# EAGLE design Schematic (EAGLE 9.6.2)
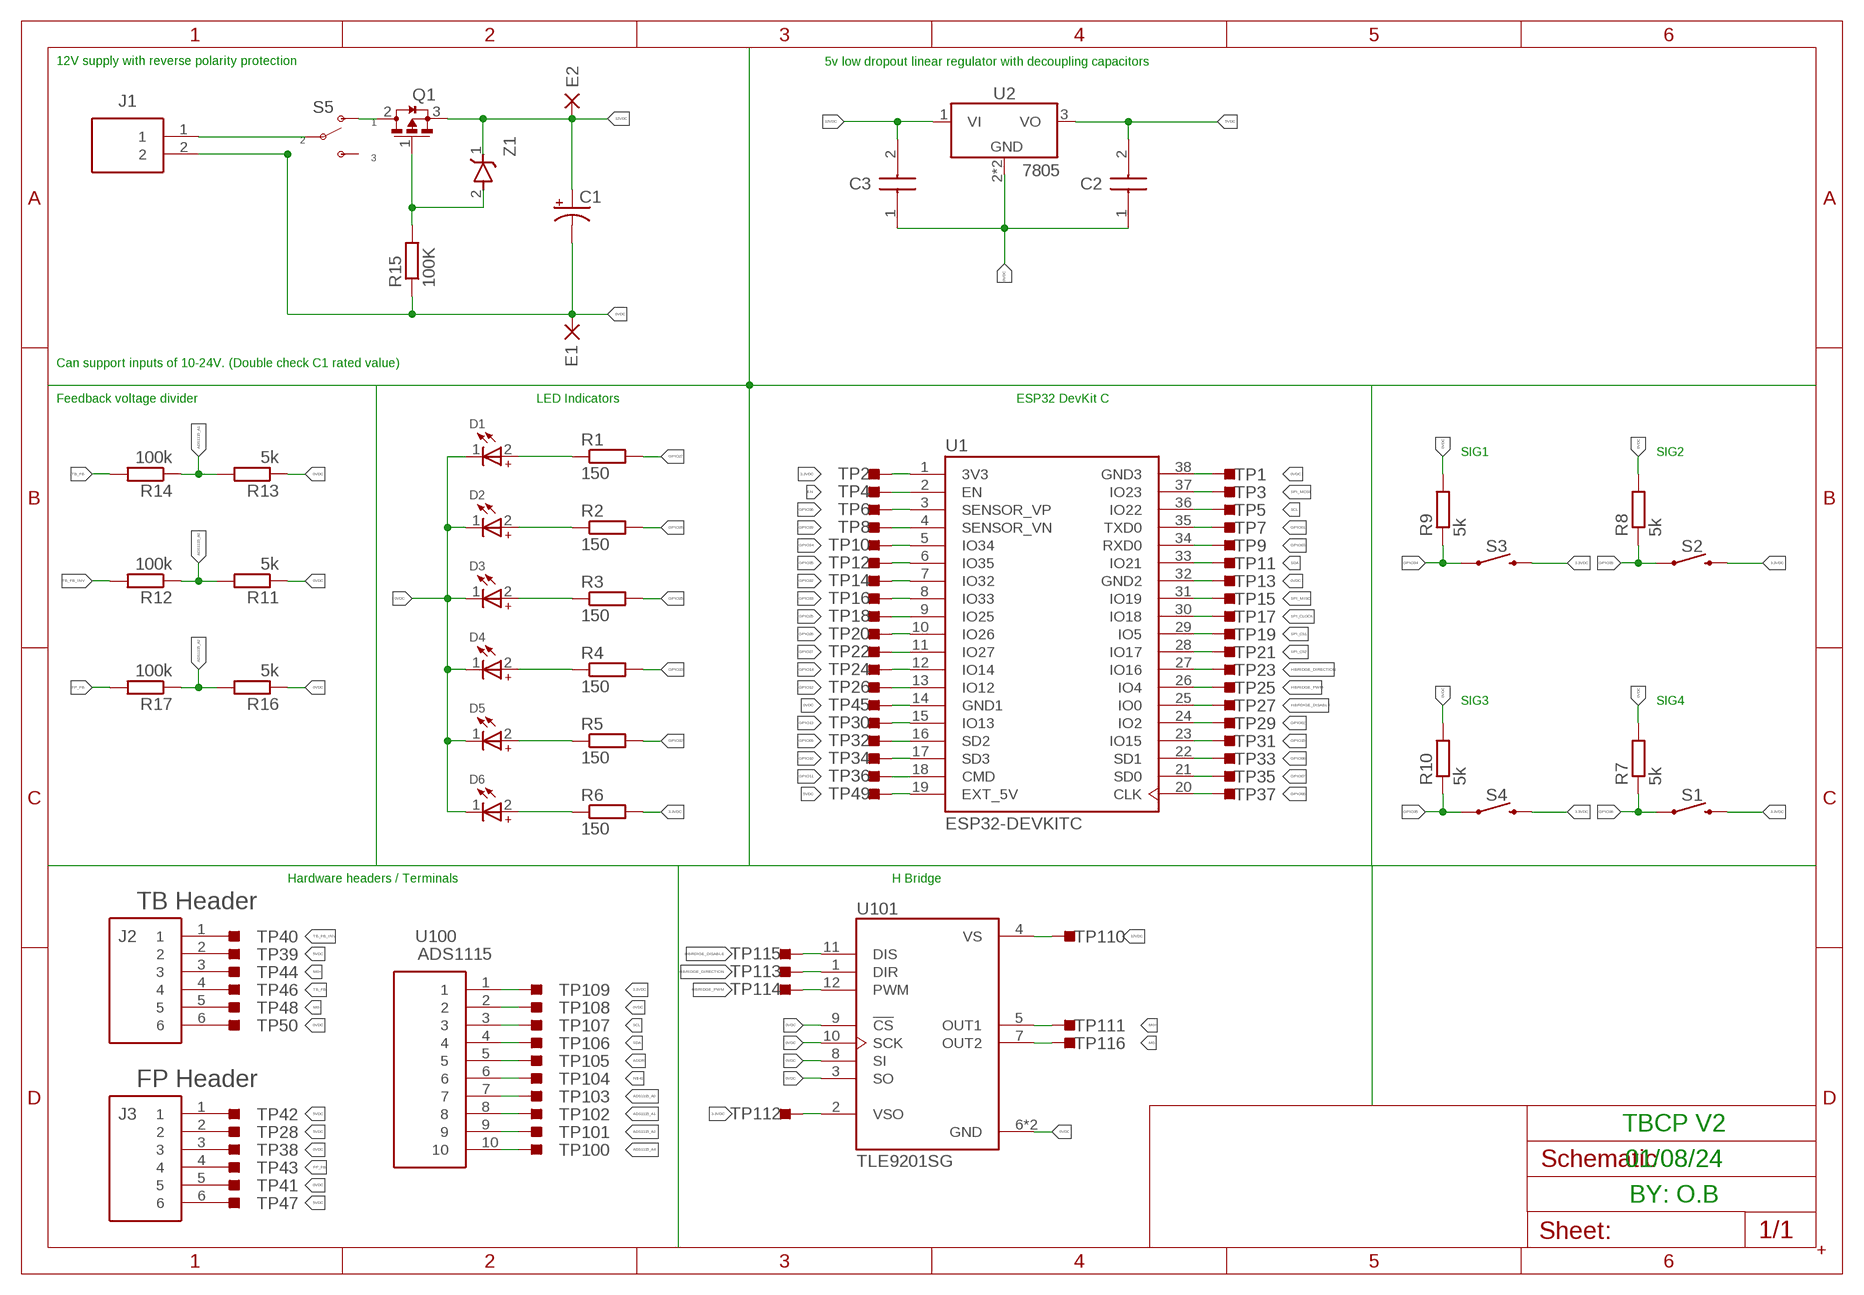
[diagram p0: schematic, sheet 1]

## Parts
C1  CAPACITOR-PTAP5-80  [TAP5-80]
C2  C0805C224J1RACTU  [C0805]
C3  C0805C224J1RACTU  [C0805]
D1  150080AS75000  WL-SMCW_0805_150080AS75000  [WL-SMCW_0805]
D2  150080AS75000  WL-SMCW_0805_150080AS75000  [WL-SMCW_0805]
D3  150080AS75000  WL-SMCW_0805_150080AS75000  [WL-SMCW_0805]
D4  150080AS75000  WL-SMCW_0805_150080AS75000  [WL-SMCW_0805]
D5  150080AS75000  WL-SMCW_0805_150080AS75000  [WL-SMCW_0805]
D6  150080AS75000  WL-SMCW_0805_150080AS75000  [WL-SMCW_0805]
E1  DPADS_PAD-0400-S  [DPADS_0400-S]
E2  DPADS_PAD-0400-S  [DPADS_0400-S]
J1  12 Supply  1757284  [1757284]
J2  TB Header  1757284  [1757284]
J3  FP Header  1757284  [1757284]
Q1  DMP4025LK3Q-13  [DMP4025LK3Q13]
R1  150  R-EU_R2012  [R2012]
R2  150  R-EU_R2012  [R2012]
R3  150  R-EU_R2012  [R2012]
R4  150  R-EU_R2012  [R2012]
R5  150  R-EU_R2012  [R2012]
R6  150  R-EU_R2012  [R2012]
R7  5k  R-EU_R2012  [R2012]
R8  5k  R-EU_R2012  [R2012]
R9  5k  R-EU_R2012  [R2012]
R10  5k  R-EU_R2012  [R2012]
R11  5k  R-EU_R2012  [R2012]
R12  100k  R-EU_R2012  [R2012]
R13  5k  R-EU_R2012  [R2012]
R14  100k  R-EU_R2012  [R2012]
R15  100K  R-EU_R2012  [R2012]
R16  5k  R-EU_R2012  [R2012]
R17  100k  R-EU_R2012  [R2012]
S1  MOMENTARY-SWITCH-SPST  [TACTILE_SWITCH_PTH_6.0MM]
S2  MOMENTARY-SWITCH-SPST  [TACTILE_SWITCH_PTH_6.0MM]
S3  MOMENTARY-SWITCH-SPST  [TACTILE_SWITCH_PTH_6.0MM]
S4  MOMENTARY-SWITCH-SPST  [TACTILE_SWITCH_PTH_6.0MM]
S5  500SSP1S1M6QEA  [500SSP1S1M6QEA]
TP1  TESTPOINT_TPS-SMD-10SN  [TESTPOINT_SMD-10SN]
TP2  3V3  TESTPOINT_TPS-SMD-10SN  [TESTPOINT_SMD-10SN]
TP3  TESTPOINT_TPS-SMD-10SN  [TESTPOINT_SMD-10SN]
TP4  EN  TESTPOINT_TPS-SMD-10SN  [TESTPOINT_SMD-10SN]
TP5  TESTPOINT_TPS-SMD-10SN  [TESTPOINT_SMD-10SN]
TP6  GPIO36  TESTPOINT_TPS-SMD-10SN  [TESTPOINT_SMD-10SN]
TP7  TESTPOINT_TPS-SMD-10SN  [TESTPOINT_SMD-10SN]
TP8  GPIO39  TESTPOINT_TPS-SMD-10SN  [TESTPOINT_SMD-10SN]
TP9  TESTPOINT_TPS-SMD-10SN  [TESTPOINT_SMD-10SN]
TP10  GPIO34  TESTPOINT_TPS-SMD-10SN  [TESTPOINT_SMD-10SN]
TP11  TESTPOINT_TPS-SMD-10SN  [TESTPOINT_SMD-10SN]
TP12  GPIO35  TESTPOINT_TPS-SMD-10SN  [TESTPOINT_SMD-10SN]
TP13  TESTPOINT_TPS-SMD-10SN  [TESTPOINT_SMD-10SN]
TP14  GPIO32  TESTPOINT_TPS-SMD-10SN  [TESTPOINT_SMD-10SN]
TP15  TESTPOINT_TPS-SMD-10SN  [TESTPOINT_SMD-10SN]
TP16  TESTPOINT_TPS-SMD-10SN  [TESTPOINT_SMD-10SN]
TP17  TESTPOINT_TPS-SMD-10SN  [TESTPOINT_SMD-10SN]
TP18  TESTPOINT_TPS-SMD-10SN  [TESTPOINT_SMD-10SN]
TP19  TESTPOINT_TPS-SMD-10SN  [TESTPOINT_SMD-10SN]
TP20  TESTPOINT_TPS-SMD-10SN  [TESTPOINT_SMD-10SN]
TP21  TESTPOINT_TPS-SMD-10SN  [TESTPOINT_SMD-10SN]
TP22  TESTPOINT_TPS-SMD-10SN  [TESTPOINT_SMD-10SN]
TP23  TESTPOINT_TPS-SMD-10SN  [TESTPOINT_SMD-10SN]
TP24  TESTPOINT_TPS-SMD-10SN  [TESTPOINT_SMD-10SN]
TP25  TESTPOINT_TPS-SMD-10SN  [TESTPOINT_SMD-10SN]
TP26  TESTPOINT_TPS-SMD-10SN  [TESTPOINT_SMD-10SN]
TP27  TESTPOINT_TPS-SMD-10SN  [TESTPOINT_SMD-10SN]
TP28  TESTPOINT_TPS-SMD-10SN  [TESTPOINT_SMD-10SN]
TP29  TESTPOINT_TPS-SMD-10SN  [TESTPOINT_SMD-10SN]
TP30  TESTPOINT_TPS-SMD-10SN  [TESTPOINT_SMD-10SN]
TP31  TESTPOINT_TPS-SMD-10SN  [TESTPOINT_SMD-10SN]
TP32  TESTPOINT_TPS-SMD-10SN  [TESTPOINT_SMD-10SN]
TP33  TESTPOINT_TPS-SMD-10SN  [TESTPOINT_SMD-10SN]
TP34  TESTPOINT_TPS-SMD-10SN  [TESTPOINT_SMD-10SN]
TP35  TESTPOINT_TPS-SMD-10SN  [TESTPOINT_SMD-10SN]
TP36  TESTPOINT_TPS-SMD-10SN  [TESTPOINT_SMD-10SN]
TP37  TESTPOINT_TPS-SMD-10SN  [TESTPOINT_SMD-10SN]
TP38  TESTPOINT_TPS-SMD-10SN  [TESTPOINT_SMD-10SN]
TP39  TESTPOINT_TPS-SMD-10SN  [TESTPOINT_SMD-10SN]
TP40  TESTPOINT_TPS-SMD-10SN  [TESTPOINT_SMD-10SN]
TP41  TESTPOINT_TPS-SMD-10SN  [TESTPOINT_SMD-10SN]
TP42  TESTPOINT_TPS-SMD-10SN  [TESTPOINT_SMD-10SN]
TP43  TESTPOINT_TPS-SMD-10SN  [TESTPOINT_SMD-10SN]
TP44  TESTPOINT_TPS-SMD-10SN  [TESTPOINT_SMD-10SN]
TP45  TESTPOINT_TPS-SMD-10SN  [TESTPOINT_SMD-10SN]
TP46  TESTPOINT_TPS-SMD-10SN  [TESTPOINT_SMD-10SN]
TP47  TESTPOINT_TPS-SMD-10SN  [TESTPOINT_SMD-10SN]
TP48  TESTPOINT_TPS-SMD-10SN  [TESTPOINT_SMD-10SN]
TP49  TESTPOINT_TPS-SMD-10SN  [TESTPOINT_SMD-10SN]
TP50  TESTPOINT_TPS-SMD-10SN  [TESTPOINT_SMD-10SN]
TP100  TESTPOINT_TPS-SMD-10SN  [TESTPOINT_SMD-10SN]
TP101  TESTPOINT_TPS-SMD-10SN  [TESTPOINT_SMD-10SN]
TP102  TESTPOINT_TPS-SMD-10SN  [TESTPOINT_SMD-10SN]
TP103  TESTPOINT_TPS-SMD-10SN  [TESTPOINT_SMD-10SN]
TP104  TESTPOINT_TPS-SMD-10SN  [TESTPOINT_SMD-10SN]
TP105  TESTPOINT_TPS-SMD-10SN  [TESTPOINT_SMD-10SN]
TP106  TESTPOINT_TPS-SMD-10SN  [TESTPOINT_SMD-10SN]
TP107  TESTPOINT_TPS-SMD-10SN  [TESTPOINT_SMD-10SN]
TP108  TESTPOINT_TPS-SMD-10SN  [TESTPOINT_SMD-10SN]
TP109  TESTPOINT_TPS-SMD-10SN  [TESTPOINT_SMD-10SN]
TP110  TESTPOINT_TPS-SMD-10SN  [TESTPOINT_SMD-10SN]
TP111  TESTPOINT_TPS-SMD-10SN  [TESTPOINT_SMD-10SN]
TP112  TESTPOINT_TPS-SMD-10SN  [TESTPOINT_SMD-10SN]
TP113  TESTPOINT_TPS-SMD-10SN  [TESTPOINT_SMD-10SN]
TP114  TESTPOINT_TPS-SMD-10SN  [TESTPOINT_SMD-10SN]
TP115  TESTPOINT_TPS-SMD-10SN  [TESTPOINT_SMD-10SN]
TP116  TESTPOINT_TPS-SMD-10SN  [TESTPOINT_SMD-10SN]
U1  ESP32-DEVKITC  [MODULE_ESP32-DEVKITC]
U2  7805  LM7805_SOT223  [SOT230P700X170-4]
U100  ADS1115  [ADS111X]
U101  TLE9201SG  [IC_TLE9201SG]
U$1  WINTEC  [WINTEC]
Z1  MM5Z10VT1G  [SODFL1608X70N]

## Nets
0VDC: C1.- C2.1 C3.1 D1.1(-) D2.1(-) D3.1(-) D4.1(-) D5.1(-) D6.1(-) E1.PAD(P) J1.2 J2.6 J3.3 J3.5 R7.2 R8.2 R9.2 R10.2 R11.1 R13.1 R15.1 R16.1 TP1.TP TP13.TP TP28.TP TP41.TP TP45.TP TP50.TP TP108.TP U1.14(GND1) U1.32(GND2) U1.38(GND3) U2.2(GND) U2.4(GND) U100.2 U101.3(SO) U101.6(GND) U101.8(SI) U101.9(!CS) U101.10(SCK) U101.13(GND)
3.3VDC: R6.2 S1.3 S2.3 S3.3 S4.3 TP2.TP TP109.TP TP112.TP U1.1(3V3) U100.1 U101.2(VSO)
5VDC: C2.2 J2.2 J3.1 J3.2 J3.6 TP38.TP TP39.TP TP42.TP TP47.TP TP49.TP U1.19(EXT_5V) U2.3(VO)
12VDC: C1.+ C3.2 E2.PAD(P) Q1.3(S) TP110.TP U2.1(VI) U101.4(VS) Z1.1(K)
ADDR: TP105.TP U100.5
ADS1115_A0: R11.2 R12.1 TP103.TP U100.7
ADS1115_A1: R13.2 R14.1 TP102.TP U100.8
ADS1115_A2: R16.2 R17.1 TP101.TP U100.9
ADS1115_A4: TP100.TP U100.10
EN: TP4.TP U1.2(EN)
FP_FB: J3.4 R17.2 TP43.TP
GPIO01: TP7.TP U1.35(TXD0)
GPIO02: TP29.TP U1.24(IO2)
GPIO03: TP9.TP U1.34(RXD0)
GPIO06: TP37.TP U1.20(CLK)
GPIO07: TP35.TP U1.21(SD0)
GPIO08: TP33.TP U1.22(SD1)
GPIO09: TP32.TP U1.16(SD2)
GPIO10: TP34.TP U1.17(SD3)
GPIO11: TP36.TP U1.18(CMD)
GPIO12: TP26.TP U1.13(IO12)
GPIO13: TP30.TP U1.15(IO13)
GPIO14: TP24.TP U1.12(IO14)
GPIO15: TP31.TP U1.23(IO15)
GPIO25: R3.2 TP18.TP U1.9(IO25)
GPIO26: R2.2 TP20.TP U1.10(IO26)
GPIO27: R1.2 TP22.TP U1.11(IO27)
GPIO32: R5.2 TP14.TP U1.7(IO32)
GPIO33: R4.2 TP16.TP U1.8(IO33)
GPIO34: R9.1 S3.1 TP10.TP U1.5(IO34)
GPIO35: R10.1 S4.1 TP12.TP U1.6(IO35)
GPIO36: R7.1 S1.1 TP6.TP U1.3(SENSOR_VP)
GPIO39: R8.1 S2.1 TP8.TP U1.4(SENSOR_VN)
HBRDIGE_DISABLE: TP27.TP TP115.TP U1.25(IO0) U101.11(DIS)
HBRIDGE_DIRECTION: TP23.TP TP113.TP U1.27(IO16) U101.1(DIR)
HBRIDGE_PWM: TP25.TP TP114.TP U1.26(IO4) U101.12(PWM)
M0+: J2.3 TP44.TP TP111.TP U101.5(OUT1)
M0-: J2.5 TP48.TP TP116.TP U101.7(OUT2)
N$1: J1.1 S5.2
N$2: D6.2(+) R6.1
N$3: D1.2(+) R1.1
N$7: Q1.1(G) R15.2 Z1.2(A)
N$8: D2.2(+) R2.1
N$9: D3.2(+) R3.1
N$12: D4.2(+) R4.1
N$13: D5.2(+) R5.1
N$36: Q1.2(D) S5.1
N$41: TP104.TP U100.6
SCL: TP5.TP TP107.TP U1.36(IO22) U100.3
SDA: TP11.TP TP106.TP U1.33(IO21) U100.4
SPI_CLOCK: TP17.TP U1.30(IO18)
SPI_CS1: TP19.TP U1.29(IO5)
SPI_CS2: TP21.TP U1.28(IO17)
SPI_MISO: TP15.TP U1.31(IO19)
SPI_MOSI: TP3.TP U1.37(IO23)
TB_FB: J2.4 R14.2 TP46.TP
TB_FB_INV: J2.1 R12.2 TP40.TP
Unconnected: S5.3

## Notes on the sheet
- 12V supply with reverse polarity protection | 5v low dropout linear regulator with decoupling capacitors
- Can support inputs of 10-24V. (Double check C1 rated value)
- Feedback voltage divider | LED Indicators | ESP32 DevKit C
- SIG1 | SIG2
- SIG3 | SIG4
- Hardware headers / Terminals | H Bridge
- TBCP V2
- 01/08/24
- BY: O.B

## Library data of the parts
C1 = BeagleBone_Blue_R3:CAPACITOR-P: POLARIZED CAPACITOR, American symbol
C2 C3 = C0805C224J1RACTU:C0805C224J1RACTU: SMD Comm X7R, Ceramic, 0.22 uF, 5%, 100 VDC, 250 VDC, 125C, -55C, X7R, SMD, MLCC, Temperature Stable, Class II, 2.5 % , 2.2727 GOhms, 21 mg, 0805, 2mm, 1.25mm, 1.25mm, 0.75mm, 0.5mm, 2500, 78 Weeks, 80 Source: Datasheet; DESCRIPTION: SMD Comm X7R, Ceramic, 0.22 uF, 5%, 100 VDC, 250 VDC, 125C, -55C, X7R, SMD, MLCC, Temperature Stable, Class II, 2.5 % , 2.2727 GOhms, 21 mg, 0805, 2mm, 1.25mm, 1.25mm, 0.75mm, 0.5mm, 2500, 78 Weeks, 80; HEIGHT: 1.1mm; MANUFACTURER_NAME: KEMET; MANUFACTURER_PART_NUMBER: C0805C224J1RACTU
D1-D6 = Wurth_LEDs_WL-SMCW:WL-SMCW_0805: WL-SMCW SMT Mono-color Chip LED Waterclea Characteristics Low energy consumption High reliability Low current requirement Fast switching No UV/IR radiation Smallest SMD LED package for exceptional brightness Top view LED Wide viewing angle Better solder ability Heat dissipation Applications Backlight for mobile and portable device keypads Indoor and outdoor message boards Flat backlight for LCDs, switches and symbols Display for industrial control systems and traffic Miniaturized color effects Pedestrian mark Optical indicators Tabular backlight: LCD, telephone key-press, power-switch, display board Indoor displays Signals Identifiers Backlight for automobile DVD LED General lighting Toys Details see: www.we-online.com/catalog/WL-SMCW Updated by Ella Wu, 2022-06-16 2022(C) Wurth Elektronik; CHIP-TECHNOLOGY: AlInGaP; DATASHEET-URL: https://www.we-online.com/redexpert/spec/150080AS75000?ae; DOMINANT-WAVELENGTH: 605nm; EMITTING-COLOR: Amber; FORWARD-VOLTAGE: 140°; LUMINOUS-INTENSITY: 130mcd; PART-NUMBER: 150080AS75000; PEAK-WAVELENGTH: 610nm
E1 E2 = 52101-101-REV-A_v16:DPADS_PAD: WIRE PAD Standard US Drill Sizes and SMD pads; BOM: EXCLUDE
J1 = Terminal 5.08 Pitch 2S :1757284: PCB header, nominal cross section: 2.5 mm?, color: green, nominal current: 12 A, rated voltage (III/2): 320 V, contact surface: Tin, type of contact: Male connector, Number of potentials: 6, Number of rows: 1, Number of positions per row: 6, number of connections: 6, product range: MSTBA 2,5/..-G, pitch: 5.08 mm, mounting: Wave soldering, pin layout: Linear pinning, solder pin [P]: 3.5 mm, Stecksystem: CLASSIC COMBICON, Locking: without, type of packaging: packed in cardboard Source: Datasheet; DESCRIPTION: PCB header, nominal cross section: 2.5 mm?, color: green, nominal current: 12 A, rated voltage (III/2): 320 V, contact surface: Tin, type of contact: Male connector, Number of potentials: 6, Number of rows: 1, Number of positions per row: 6, number of connections: 6, product range: MSTBA 2,5/..-G, pitch: 5.08 mm, mounting: Wave soldering, pin layout: Linear pinning, solder pin [P]: 3.5 mm, Stecksystem: CLASSIC COMBICON, Locking: without, type of packaging: packed in cardboard; HEIGHT: 8.72mm; MANUFACTURER_NAME: Phoenix Contact; MANUFACTURER_PART_NUMBER: 1757284
J2 J3 = Terminal 5.08 Pitch 6S 1757284:1757284: PCB header, nominal cross section: 2.5 mm?, color: green, nominal current: 12 A, rated voltage (III/2): 320 V, contact surface: Tin, type of contact: Male connector, Number of potentials: 6, Number of rows: 1, Number of positions per row: 6, number of connections: 6, product range: MSTBA 2,5/..-G, pitch: 5.08 mm, mounting: Wave soldering, pin layout: Linear pinning, solder pin [P]: 3.5 mm, Stecksystem: CLASSIC COMBICON, Locking: without, type of packaging: packed in cardboard Source: Datasheet; DESCRIPTION: PCB header, nominal cross section: 2.5 mm?, color: green, nominal current: 12 A, rated voltage (III/2): 320 V, contact surface: Tin, type of contact: Male connector, Number of potentials: 6, Number of rows: 1, Number of positions per row: 6, number of connections: 6, product range: MSTBA 2,5/..-G, pitch: 5.08 mm, mounting: Wave soldering, pin layout: Linear pinning, solder pin [P]: 3.5 mm, Stecksystem: CLASSIC COMBICON, Locking: without, type of packaging: packed in cardboard; HEIGHT: 8.72mm; MANUFACTURER_NAME: Phoenix Contact; MANUFACTURER_PART_NUMBER: 1757284
Q1 = DMP4025LK3Q-13:DMP4025LK3Q-13: P-Channel MOSFET, 8.6 A, 40 V, 2-Pin DPAK Diodes Inc DMP4025LK3Q-13 Source: Datasheet; DESCRIPTION: P-Channel MOSFET, 8.6 A, 40 V, 2-Pin DPAK Diodes Inc DMP4025LK3Q-13; HEIGHT: 2.52mm; MANUFACTURER_NAME: Diodes Incorporated; MANUFACTURER_PART_NUMBER: DMP4025LK3Q-13
R1-R17 = rcl:R-EU_: RESISTOR, European symbol; SPICEPREFIX: R
S1-S4 = 12mm TAC SWITCH:MOMENTARY-SWITCH-SPST: Momentary Switch (Pushbutton) - SPST Normally-open (NO) SPST momentary switches (buttons, pushbuttons). Variants PTH-12MM - 12mm square, through-hole Momentary Pushbutton Switch - 12mm Square (COM-09190) PTH-6.0MM, PTH-6.0MM-KIT - 6.0mm square, through-hole Mini Pushbutton Switch (COM-00097) KIT package intended for soldering kit's - only one side of pads' copper is exposed. PTH-RIGHT-ANGLE-KIT - Right-angle, through-hole Right Angle Tactile Button - Used on SparkFun BigTime Watch Kit SMD-12MM - 12mm square, surface-mount Tactile Button - SMD (12mm) (COM-12993) Used on SparkFun PicoBoard SMD-4.5MM - 4.5mm Square Trackball Switch Used on SparkFun Blackberry Trackballer Breakout SMD-4.6MMX2.8MM - 4.60mm x 2.80mm, surface mount Used on SparkFun Pro Micro - RP2040 SMD-5.2MM, SMD-5.2-REDUNDANT - 5.2mm square, surface-mount Mini Pushbutton Switch - SMD (COM-08720) Used on Arduino Pro Mini REDUNDANT package connects both switch circuits together SMD-6.0X3.5MM - 6.0 x 3.5mm, surface mount Momentary Reset Switch SMD (COM-08229) SMD-6.2MM-TALL - 6.2mm square, surface mount Tactile Button - SMD (6mm) Used on SparkFun Digital Sandbox SMD-RIGHT-ANGLE - Right-angle, surface mount Used on SparkFun Block for Intel® Edison - Arduino
S5 = 500SSP1S1M6QEA:500SSP1S1M6QEA: SLIDE, 5A, 120VAC/28VDC SPDT, On-On Through Hole, Right Angle Source: Datasheet https://configured-product-images.s3.amazonaws.com/2D/specs/500SSP1S1M6QEA.pdf
TP1-TP50 TP100-TP116 = 52101-101-REV-A_v16:TESTPOINT_TPS: TEST POINT PAD; BOM: EXCLUDE
U1 = ESP32-DEVKITC:ESP32-DEVKITC: ESP32-DEVKITC Check availability; AVAILABILITY: In Stock; CHECK_PRICES: https://www.snapeda.com/parts/ESP32-DEVKITC/Espressif+Systems/view-part/?ref=eda; DESCRIPTION: ESP32-WROOM-32UE series Transceiver; 802.11 b/g/n (Wi-Fi, WiFi, WLAN), Bluetooth ® Smart Ready 4.x Dual Mode Evaluation Board; MF: Espressif Systems; MP: ESP32-DEVKITC; PACKAGE: None; PRICE: None; SNAPEDA_LINK: https://www.snapeda.com/parts/ESP32-DEVKITC/Espressif+Systems/view-part/?ref=snap
U2 = IC_Power-Management:LM7805: 5V Voltage Regulator Reference Datasheet; CATEGORY: IC_Logic; DESCRIPTION: 5V Voltage Regulator; MANUFACTURER: Generic; MPN: Generic; SERIES: LM7805; SUB-CATEGORY: Voltage Regulator; TYPE: 5V
U100 = ADS1115:ADS1115
U101 = TLE9201SG:TLE9201SG: Check availability; AVAILABILITY: In Stock; CHECK_PRICES: https://www.snapeda.com/parts/TLE9201SG/Infineon+Technologies/view-part/?ref=eda; DESCRIPTION: IC, 6A, H-bridge with SPI driver, 3.3/5V, DSO12, low standby current | Infineon TLE9201SG; MF: Infineon Technologies; MP: TLE9201SG; PACKAGE: BSOP-12 Infineon; PRICE: None; PURCHASE-URL: https://www.snapeda.com/api/url_track_click_mouser/?unipart_id=526011&manufacturer=Infineon Technologies&part_name=TLE9201SG&search_term=None; SNAPEDA_LINK: https://www.snapeda.com/parts/TLE9201SG/Infineon+Technologies/view-part/?ref=snap
U$1 = Wintec Logo:WINTEC
Z1 = MM5Z10VT1G:MM5Z10VT1G: ON Semiconductor MM5Z10VT1G Zener Diode, 10V 5% 500 mW SMT 2-Pin SOD-523 Source: Datasheet; DESCRIPTION: ON Semiconductor MM5Z10VT1G Zener Diode, 10V 5% 500 mW SMT 2-Pin SOD-523; HEIGHT: 0.7mm; MANUFACTURER_NAME: onsemi; MANUFACTURER_PART_NUMBER: MM5Z10VT1G

## Board
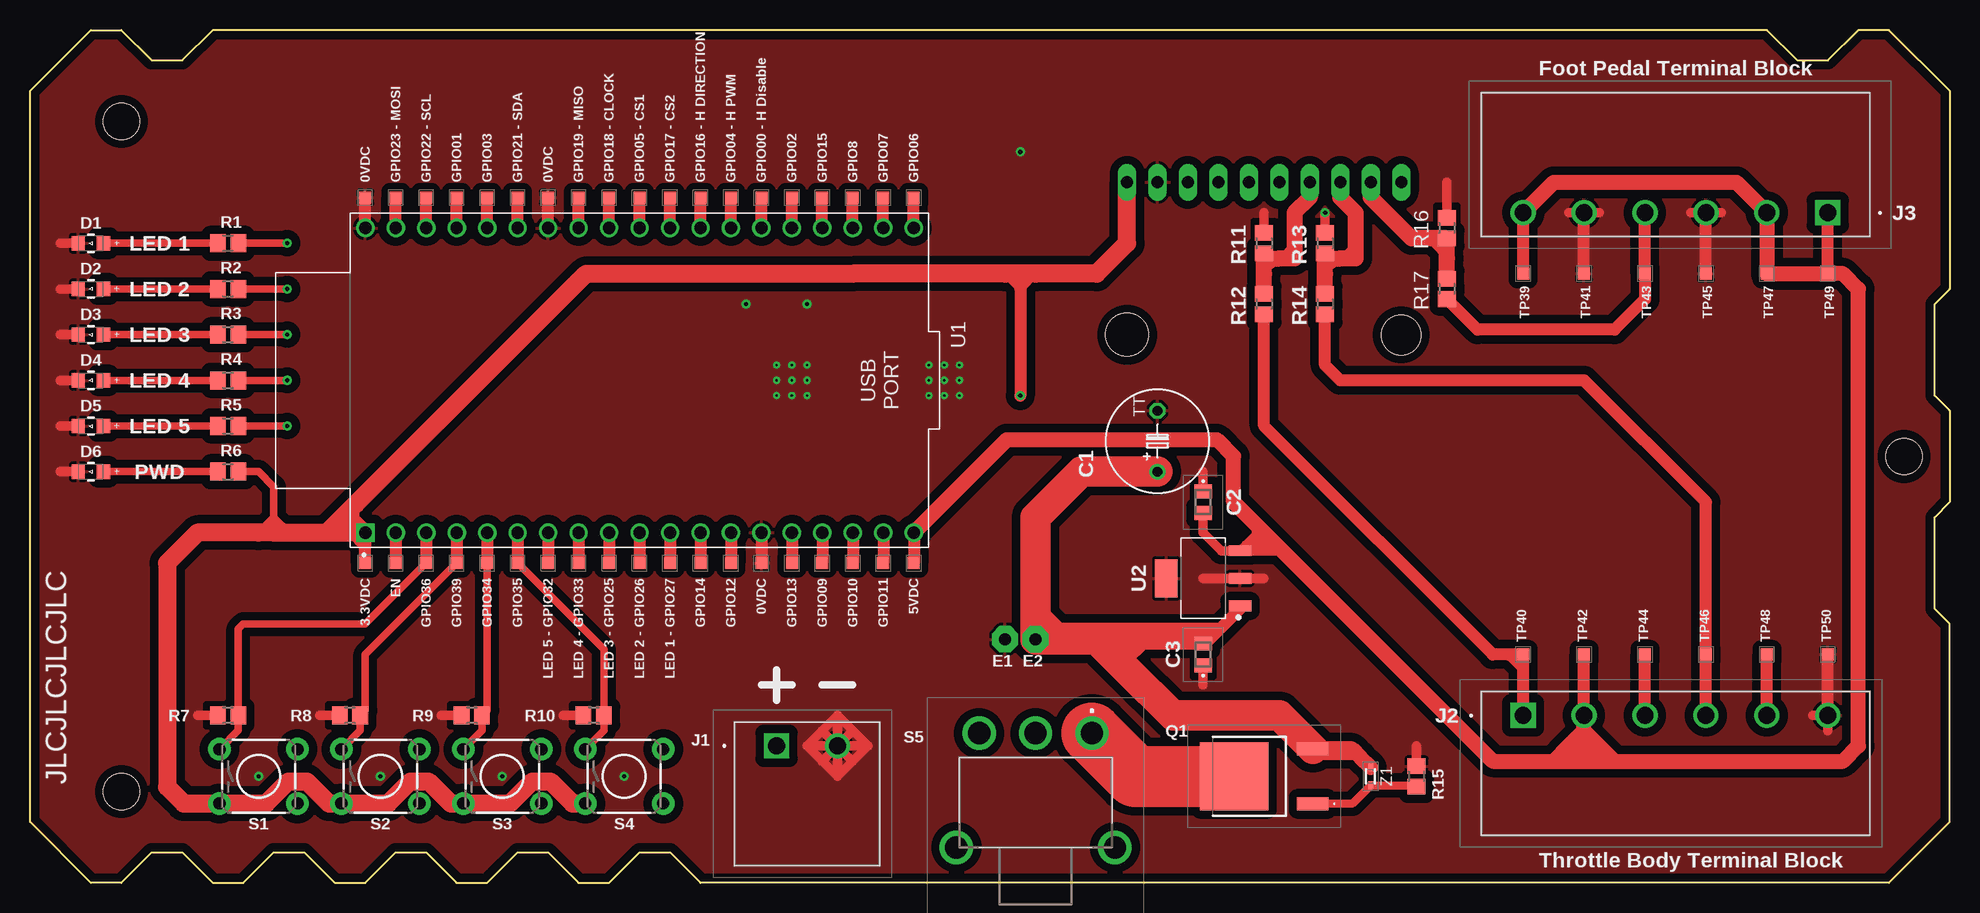
[diagram p1: board, top side]
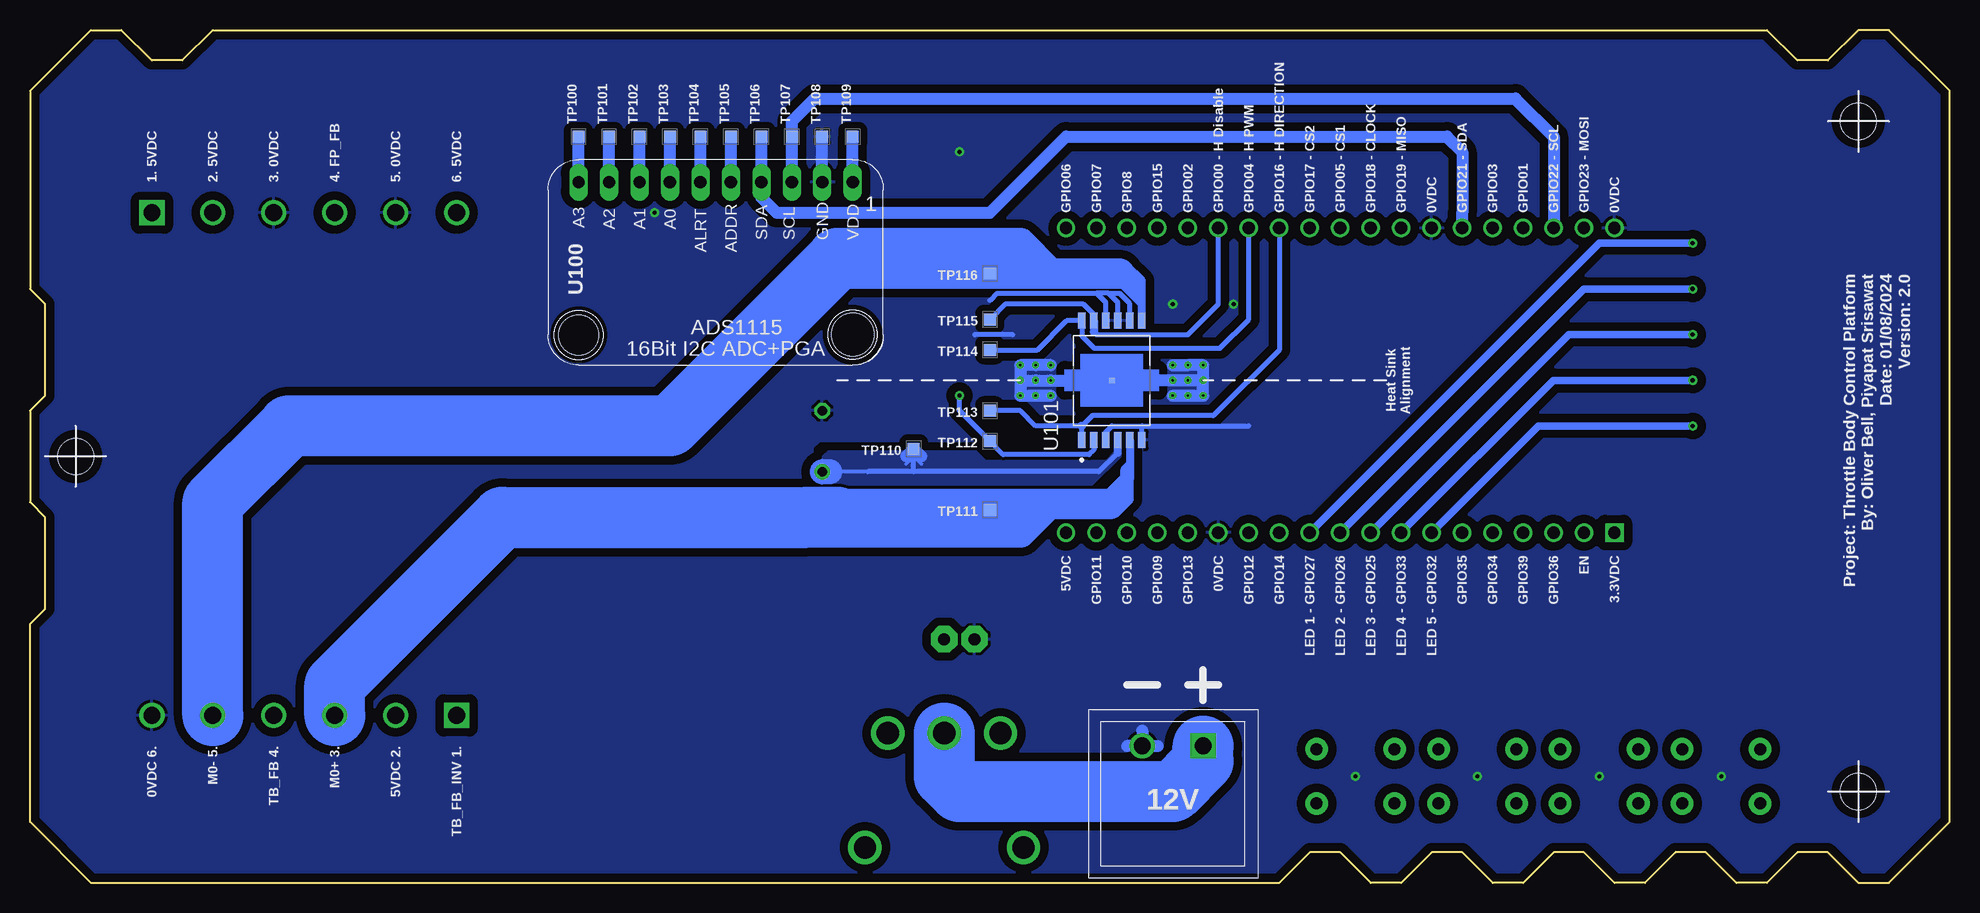
[diagram p2: board, bottom side, seen from below]

Size 160.02 x 71.12 mm. Coordinates in mm from the lower left corner, seen from the top.
Outline: 160.02,66.04 160.02,49.53 158.75,48.26 158.75,40.64 160.02,39.37 160.02,31.75 158.75,30.48 158.75,22.86 160.02,21.59 160.02,5.08 154.94,0 55.88,0 53.34,2.54 50.8,2.54 48.26,0 45.72,0 43.18,2.54 40.64,2.54 38.1,0 35.56,0 33.02,2.54 30.48,2.54 27.94,0 25.4,0 22.86,2.54 20.32,2.54 17.78,0 15.24,0 12.7,2.54 10.16,2.54 7.62,0 5.08,0 0,5.08 0,66.04 5.08,71.12 7.62,71.12 10.16,68.58 12.7,68.58 15.24,71.12 144.78,71.12 147.32,68.58 149.86,68.58 152.4,71.12 154.94,71.12 160.02,66.04
Copper layers (1*16): Top 0.035mm / dielectric 1.5mm / Bottom 0.035mm
Design rules "default *": minimum track width 6mil, minimum drill 0.35mm, track to track 6mil, track to pad 6mil, pad to pad 6mil, via to via 6mil, smd to smd 6mil, copper to edge 0.5mm, drill to drill 6mil, minimum pad ring 10mil, minimum via ring 8mil, stop-mask expansion 0.3mm, vias tented up to drill 0mil, thermal gap 10mil
Holes 3 mm at 7.62,63.5 7.62,7.62 156.21,35.56

### Footprints (pad centres in the part's own frame; a part is rotated, then mirrored left to right if it is on the bottom)
TAP5-80 = drill 0.813: + -2.54,0 | drill 0.813 octagon: - 2.54,0
C0805 = smd 1.15 x 1.45: 1 -0.9,0; 2 0.9,0
WL-SMCW_0805 = smd 1.1 x 1.2: 1 -1.05,0; 2 1.05,0
DPADS_0400-S = drill 1.016 pad 2.184 octagon: PAD 0,0
1757284 = drill 1.4 pad 2.1 square: 1 0,0 | drill 1.4 pad 2.1: 2 5.08,0
1757284' = drill 1.4 pad 2.1 square: 1 0,0 | drill 1.4 pad 2.1: 2 5.08,0; 3 10.16,0; 4 15.24,0; 5 20.32,0; 6 25.4,0
DMP4025LK3Q13 = smd 1.06 x 2.6: 1 -2.286,-4.05; 3 2.286,-4.05 | smd 5.632 x 5.7: 2 0,2.5
R2012 = smd 1.3 x 1.5: 1 -0.85,0; 2 0.85,0
TACTILE_SWITCH_PTH_6.0MM = drill 1.016 pad 1.88: 1 -3.251,2.261; 2 3.251,2.261; 3 -3.251,-2.261; 4 3.251,-2.261
500SSP1S1M6QEA = drill 1.85 pad 2.775: 1 6.14,-4.7; 2 6.14,0; 3 6.14,4.7; 4 -3.39,-6.605; 5 -3.39,6.605
TESTPOINT_SMD-10SN = smd 1 x 1: TP 0,0
MODULE_ESP32-DEVKITC = drill 1.02 square: 1 -12.7,22.85 | drill 1.02: 2 -12.7,20.31; 3 -12.7,17.77; 4 -12.7,15.23; 5 -12.7,12.69; 6 -12.7,10.15; 7 -12.7,7.61; 8 -12.7,5.07; 9 -12.7,2.53; 10 -12.7,-0.01; 11 -12.7,-2.55; 12 -12.7,-5.09; 13 -12.7,-7.63; 14 -12.7,-10.17; 15 -12.7,-12.71; 16 -12.7,-15.25; 17 -12.7,-17.79; 18 -12.7,-20.33; 19 -12.7,-22.87; 20 12.7,-22.87; 21 12.7,-20.33; 22 12.7,-17.79; 23 12.7,-15.25; 24 12.7,-12.71; 25 12.7,-10.17; 26 12.7,-7.63; 27 12.7,-5.09; 28 12.7,-2.55; 29 12.7,-0.01; 30 12.7,2.53; 31 12.7,5.07; 32 12.7,7.61; 33 12.7,10.15; 34 12.7,12.69; 35 12.7,15.23; 36 12.7,17.77; 37 12.7,20.31; 38 12.7,22.85
SOT230P700X170-4 = smd 1.86 x 0.898: 1 -3.075,2.3; 2 -3.075,0; 3 -3.075,-2.3 | smd 1.86 x 3.189: 4 3.075,0
ADS111X = drill 1.016 long: 1 3.81,0; 2 6.35,0; 3 8.89,0; 4 11.43,0; 5 13.97,0; 6 16.51,0; 7 19.05,0; 8 21.59,0; 9 24.13,0; 10 26.67,0 | hole 3.556: 3.81,12.7 | hole 3.302: 26.657,12.725
IC_TLE9201SG = smd 1.35 x 0.65: 1 -4.975,2.5; 2 -4.975,1.5; 3 -4.975,0.5; 4 -4.975,-0.5; 5 -4.975,-1.5; 6 -4.975,-2.5; 7 4.975,-2.5; 8 4.975,-1.5; 9 4.975,-0.5; 10 4.975,0.5; 11 4.975,1.5; 12 4.975,2.5 | smd 0.5 x 0.5: 13 0,0
SODFL1608X70N = smd 0.64 x 0.42: 1 -0.75,0; 2 0.75,0

### Placement (x,y rotation side)
C1  93.98,36.83 90 top
C2  97.79,31.75 270 top
C3  97.79,19.05 90 top
D1  5.08,53.34 0 top
D2  5.08,49.53 0 top
D3  5.08,45.72 0 top
D4  5.08,41.91 0 top
D5  5.08,38.1 0 top
D6  5.08,34.29 0 top
E1  81.28,20.32 180 top
E2  83.82,20.32 180 top
J1  62.23,11.43 0 top
J2  TB Header  [1757284']  124.46,13.97 0 top
J3  FP Header  [1757284']  149.86,55.88 180 top
Q1  102.87,8.89 90 top
R1  16.51,53.34 0 top
R2  16.51,49.53 0 top
R3  16.51,45.72 0 top
R4  16.51,41.91 0 top
R5  16.51,38.1 0 top
R6  16.51,34.29 0 top
R7  16.51,13.97 180 top
R8  26.67,13.97 180 top
R9  36.83,13.97 180 top
R10  46.99,13.97 180 top
R11  102.87,53.34 270 top
R12  102.87,48.26 270 top
R13  107.95,53.34 270 top
R14  107.95,48.26 270 top
R15  115.57,8.89 270 top
R16  118.11,54.61 270 top
R17  118.11,49.53 270 top
S1  19.05,8.89 0 top
S2  29.21,8.89 0 top
S3  39.37,8.89 0 top
S4  49.53,8.89 0 top
S5  83.82,6.35 90 top
TP1  27.94,57.15 90 top
TP2  27.94,26.67 270 top
TP3  30.48,57.15 90 top
TP4  30.48,26.67 270 top
TP5  33.02,57.15 90 top
TP6  33.02,26.67 270 top
TP7  35.56,57.15 90 top
TP8  35.56,26.67 270 top
TP9  38.1,57.15 90 top
TP10  38.1,26.67 270 top
TP11  40.64,57.15 90 top
TP12  40.64,26.67 270 top
TP13  43.18,57.15 90 top
TP14  43.18,26.67 270 top
TP15  45.72,57.15 90 top
TP16  45.72,26.67 270 top
TP17  48.26,57.15 90 top
TP18  48.26,26.67 270 top
TP19  50.8,57.15 90 top
TP20  50.8,26.67 270 top
TP21  53.34,57.15 90 top
TP22  53.34,26.67 270 top
TP23  55.88,57.15 90 top
TP24  55.88,26.67 270 top
TP25  58.42,57.15 90 top
TP26  58.42,26.67 270 top
TP27  60.96,57.15 90 top
TP28  60.96,26.67 270 top
TP29  63.5,57.15 90 top
TP30  63.5,26.67 270 top
TP31  66.04,57.15 90 top
TP32  66.04,26.67 270 top
TP33  68.58,57.15 90 top
TP34  68.58,26.67 270 top
TP35  71.12,57.15 90 top
TP36  71.12,26.67 270 top
TP37  73.66,57.15 90 top
TP38  73.66,26.67 270 top
TP39  124.46,50.8 270 top
TP40  124.46,19.05 90 top
TP41  129.54,50.8 270 top
TP42  129.54,19.05 90 top
TP43  134.62,50.8 270 top
TP44  134.62,19.05 90 top
TP45  139.7,50.8 270 top
TP46  139.7,19.05 90 top
TP47  144.78,50.8 270 top
TP48  144.78,19.05 90 top
TP49  149.86,50.8 270 top
TP50  149.86,19.05 90 top
TP100  114.3,62.23 90 bottom
TP101  111.76,62.23 90 bottom
TP102  109.22,62.23 90 bottom
TP103  106.68,62.23 90 bottom
TP104  104.14,62.23 90 bottom
TP105  101.6,62.23 90 bottom
TP106  99.06,62.23 90 bottom
TP107  96.52,62.23 90 bottom
TP108  93.98,62.23 90 bottom
TP109  91.44,62.23 90 bottom
TP110  86.36,36.2 180 bottom
TP111  80.01,31.11 180 bottom
TP112  80.01,36.83 180 bottom
TP113  80.01,39.37 180 bottom
TP114  80.01,44.45 180 bottom
TP115  80.01,46.99 180 bottom
TP116  80.01,50.8 180 bottom
U1  50.8,41.91 90 top
U2  97.79,25.4 180 top
U100  87.63,58.42 180 bottom
U101  69.85,41.91 90 bottom
U$1  111.76,30.48 0 top
Z1  111.76,8.89 270 top

### Tracks (layer width: path | path; a pad name or v marks a point on that pad's centre or on a via)
0VDC  (via drill 0.2, 0.35)
  Top 0.8: C2.1 97.79,34.29 | C3.1 97.79,16.51 | R15.1 115.57,11.43 | R10.2 44.45,13.97 | R9.2 34.29,13.97 | R8.2 24.13,13.97 | R7.2 13.97,13.97 | D6.1 2.54,34.29 | D5.1 2.54,38.1 | D4.1 2.54,41.91 | D3.1 2.54,45.72 | D2.1 2.54,49.53 | D1.1 2.54,53.34 | J1.2 69.85,11.43 | J1.2 64.77,11.43 | 149.86,12.7 J2.6 148.59,13.97 | 138.43,55.88 J3.3 140.97,55.88 | 128.27,55.88 J3.5 130.81,55.88 | R16.1 118.11,58.42 | R11.1 102.87,55.88 | R13.1 v107.95,55.88 | 97.79,25.4 U2.2 102.87,25.4 | J1.2 66.04,12.7 | J1.2 68.58,10.16 | J1.2 66.04,10.16 | J1.2 68.58,12.7 | J1.2 67.31,13.97 | J1.2 67.31,8.89 | 64.77,11.43 67.31,13.97 | 67.31,13.97 69.85,11.43 | 69.85,11.43 67.31,8.89 | 67.31,8.89 64.77,11.43
  Top 1.016: U1.38 TP1.TP | U1.32 TP13.TP | U1.14 TP28.TP | TP41.TP J3.5 | TP45.TP J3.3 | J2.6 TP50.TP
  Bottom 0.406: U101.10 70.35,48.4 71.12,49.17 | 71.12,49.17 79.41,49.17 80.01,48.58 | U101.3 70.35,37.6 69.85,38.1 67.31,38.1 | 67.31,38.1 58.42,38.1 | 70.13,49.17 71.12,49.17 | U101.6 67.35,38.06 67.31,38.1 | U101.8 68.35,48.3 69.23,49.17 70.13,49.17 | U101.9 69.35,48.4 70.13,49.17 | 78.11,45.72 81.28,45.72
  Bottom 1: v64.77,40.64 v63.5,40.64 v62.23,40.64 v62.23,41.91 | v64.77,43.18 v63.5,43.18 v62.23,43.18 v62.23,41.91 | v62.23,41.91 v63.5,41.91 v64.77,41.91 U101.13 | v74.93,43.18 v76.2,43.18 v77.47,43.18 v77.47,41.91 | v77.47,41.91 v77.47,40.64 v76.2,40.64 v74.93,40.64 | v77.47,41.91 v76.2,41.91 v74.93,41.91 70.64,41.91 | 67.31,12.7 J1.2 | J1.2 66.04,11.43 | J1.2 68.58,11.43
  Bottom 1.016: U100.2 TP108.TP
  other vias: 82.55,60.96 59.69,48.26 64.77,48.26 19.05,8.89 29.21,8.89 39.37,8.89 49.53,8.89
  pour Top (isolate 0.7, rank 6): -1.27,71.12 -1.27,0 0,-1.27 160.02,-1.27 161.29,0 161.29,71.12 160.02,72.39 0,72.39
  pour Bottom (isolate 0.7, rank 5): 162.56,-1.27 162.56,71.75 160.66,73.66 -0.64,73.66 -2.54,71.75 -2.54,-0.64 -0.64,-2.54 161.29,-2.54
  cutout Top: 18.41,54.45 14.61,54.45 14.45,54.29 14.45,52.39 14.61,52.23 18.41,52.23 18.57,52.39 18.57,54.29
  cutout Top: 96.84,16.99 98.74,16.99 98.9,17.14 98.9,20.95 98.74,21.11 96.84,21.11 96.68,20.95 96.68,17.14
  cutout Top: 44.93,14.92 44.93,13.02 45.09,12.86 48.9,12.86 49.05,13.02 49.05,14.92 48.9,15.08 45.09,15.08
  cutout Top: 34.77,14.92 34.77,13.02 34.92,12.86 38.73,12.86 38.89,13.02 38.89,14.92 38.73,15.08 34.92,15.08
  cutout Top: 24.61,14.92 24.61,13.02 24.77,12.86 28.57,12.86 28.73,13.02 28.73,14.92 28.57,15.08 24.77,15.08
  cutout Top: 14.45,14.92 14.45,13.02 14.61,12.86 18.41,12.86 18.57,13.02 18.57,14.92 18.41,15.08 14.61,15.08
  cutout Top: 14.45,35.24 14.45,33.34 14.61,33.18 18.41,33.18 18.57,33.34 18.57,35.24 18.41,35.4 14.61,35.4
  cutout Top: 14.61,36.99 18.41,36.99 18.57,37.15 18.57,39.05 18.41,39.21 14.61,39.21 14.45,39.05 14.45,37.15
  cutout Top: 14.61,40.8 18.41,40.8 18.57,40.96 18.57,42.86 18.41,43.02 14.61,43.02 14.45,42.86 14.45,40.96
  cutout Top: 14.61,44.61 18.41,44.61 18.57,44.77 18.57,46.67 18.41,46.83 14.61,46.83 14.45,46.67 14.45,44.77
  cutout Top: 18.41,50.64 14.61,50.64 14.45,50.48 14.45,48.58 14.61,48.42 18.41,48.42 18.57,48.58 18.57,50.48
  cutout Top: 103.98,46.36 103.98,50.17 103.82,50.32 101.92,50.32 101.76,50.17 101.76,46.36 101.92,46.2 103.82,46.2
  cutout Top: 109.06,46.36 109.06,50.17 108.9,50.32 107,50.32 106.84,50.17 106.84,46.36 107,46.2 108.9,46.2
  cutout Top: 103.98,51.44 103.98,55.25 103.82,55.4 101.92,55.4 101.76,55.25 101.76,51.44 101.92,51.28 103.82,51.28
  cutout Top: 109.06,51.44 109.06,55.25 108.9,55.4 107,55.4 106.84,55.25 106.84,51.44 107,51.28 108.9,51.28
  cutout Top: 119.22,52.71 119.22,56.52 119.06,56.67 117.16,56.67 117,56.52 117,52.71 117.16,52.55 119.06,52.55
  cutout Top: 119.22,47.62 119.22,51.44 119.06,51.59 117.16,51.59 117,51.44 117,47.62 117.16,47.47 119.06,47.47
  cutout Bottom: 71.75,49.53 71.75,47.62 67.94,47.62 67.94,49.53
0VDC17
  cutout Top: 96.84,29.69 98.74,29.69 98.9,29.84 98.9,33.66 98.74,33.81 96.84,33.81 96.68,33.66 96.68,29.84
3.3VDC  (via drill 0.35)
  Top 0.152: TP2.TP
  Top 0.61: 68.58,50.8 69.85,50.8 | R6.2 19.05,34.29 20.32,33.02 20.32,30.48 | 20.32,29.21 20.32,30.48 | 20.32,30.48 19.05,29.21 | 20.32,30.48 21.59,29.21
  Top 0.65: 81.28,50.8 82.55,49.53 83.82,50.8
  Top 1: 26.51,29.21 26.84,29.21 27.95,28.1 | 26.99,30 26.99,31.43 27.15,31.59 | 82.55,50.8 82.55,49.53 v82.55,40.64
  Top 1.016: U1.1 27.95,28.1 TP2.TP
  Top 1.5: 24.77,29.21 26.51,29.21 U1.1 27.78,29.21 26.99,30 26.27,30.72 | 24.77,29.21 21.59,29.21 20.32,29.21 19.05,29.21 13.97,29.21 11.43,26.67 11.43,8 12.8,6.63 S1.3 19.7,6.63 21.54,8.47 23.06,8.47 24.91,6.63 S2.3 29.86,6.63 31.7,8.47 33.22,8.47 35.07,6.63 S3.3 40.02,6.63 41.86,8.47 43.38,8.47 45.23,6.63 S4.3 | U100.1 91.44,53.34 88.9,50.8 83.82,50.8 82.55,50.8 81.28,50.8 68.58,50.8 46.35,50.8 27.15,31.59 26.27,30.72 | 24.77,29.21 26.27,30.72
  Bottom 0.406: U101.2 71.35,36.11 71.74,35.72 78.9,35.72 TP112.TP 82.55,39.37 v82.55,40.64
  Bottom 1.016: U100.1 TP109.TP
5VDC
  Top 0.8: C2.2 97.79,29.21 99.3,27.7 U2.3 | U2.3 101.6,27.7 | 101.6,27.7 102.87,27.7 | 102.87,27.7 104.38,27.7 | 104.38,27.7 105.41,26.67 | U2.3 101.35,28.19 | 101.35,28.19 102.23,29.07 102.23,29.84 | 102.87,27.7 102.38,28.19 | 102.38,28.19 101.35,28.19 | 101.6,27.7 102.87,28.97 102.87,29.21 | 104.38,27.7 103.89,28.19 102.38,28.19
  Top 1.016: U1.19 TP38.TP | TP39.TP J3.6 | TP49.TP J3.1 | J2.2 TP42.TP
  Top 1.27: U1.19 81.42,36.96 98.93,36.96 100.33,35.56 100.33,31.75 102.23,29.84 102.87,29.21 105.41,26.67 121.92,10.16 127,10.16 | 127,10.16 129.54,10.16 | 129.54,10.16 130.81,10.16 | 130.81,10.16 132.08,10.16 | 132.08,10.16 151.13,10.16 152.4,11.43 152.4,49.53 151.13,50.8 TP49.TP TP47.TP J3.2 142.24,58.42 127,58.42 J3.6 | 127,10.16 128.27,11.43 | 128.27,11.43 128.91,12.06 | 128.91,12.06 129.54,12.7 | 129.54,12.7 J2.2 | 129.54,10.16 128.27,11.43 | 130.81,10.16 128.91,12.06 | 132.08,10.16 129.54,12.7
12VDC
  Top 0.152: 100.86,22.86 U2.1 | Q1.3 106.68,11.42 | 87.63,20.32 86.36,20.32
  Top 0.508: 83.82,22.86 84.54,22.86 86.08,21.32 | Q1.3 107.56,10.54 110.86,10.54
  Top 0.8: 99.33,21.32 86.08,21.32 85.08,20.32
  Top 1: 88.9,19.95 89.27,19.95 | 98.69,20.69 97.95,19.95 C3.2 92.71,19.95 | 98.69,20.69 99.33,21.32 100.86,22.86 | 92.71,19.95 89.27,19.95 | 89.27,19.95 88.9,20.32 89.27,20.69 | 89.27,20.69 98.69,20.69 | 83.82,22.86 85.99,20.69 89.27,20.69 | 91.44,18.68 92.71,19.95
  Top 1.016: 89.8,19.95 90.17,19.95
  Top 1.27: Q1.3 110.22,11.18 110.86,10.54 Z1.1 | 91.44,17.78 91.44,18.68
  Top 1.5: E2.PAD 83.82,19.95 88.9,19.95 90.17,19.95
  Top 2.54: Q1.3 104.13,13.97 95.25,13.97 91.44,17.78 88.9,20.32 86.36,20.32 85.08,20.32 E2.PAD 83.82,22.86 83.82,30.48 87.63,34.29 C1.+
  Bottom 0.152: U101.4 69.35,36.54
  Bottom 0.305: C1.+ 93.98,33.34 | C1.+ 93.98,35.24 | 90.17,34.29 C1.+ | 85.72,34.93 86.36,35.56 87,34.93
  Bottom 0.406: 86.36,34.29 86.36,35.56 TP110.TP | 86.36,34.29 70.94,34.29 69.35,35.88 | 86.36,34.29 90.17,34.29
  Bottom 0.65: 69.35,35.88 U101.4
  Bottom 1: 85.72,35.56 TP110.TP 87,35.56
  Bottom 2.1: C1.+ 93.34,34.29
  pour Bottom (isolate 0.254): 93.98,33.18 71.44,33.18 69.06,35.56 69.06,35.88 69.69,35.88 70.33,35.24 80.33,35.24 81.12,36.04 93.5,36.04 93.98,35.56
ADDR
  Bottom 1.016: U100.5 TP105.TP
ADS1115_A0
  Top 0.152: 102.87,52.07 R11.2
  Top 0.508: 102.87,50.8 104.14,52.07 105.41,53.34
  Top 1.35: U100.7 106.68,57.15 105.41,55.88 105.41,53.34 105.41,52.07 104.14,52.07 102.87,52.07 102.87,50.8 R12.1
  Bottom 1.016: U100.7 TP103.TP
ADS1115_A1
  Top 0.508: 107.95,50.8 109.22,52.07 | R13.2 109.64,52.49 110.49,53.34
  Top 1.016: 107.95,52.07 R13.2
  Top 1.35: U100.8 109.22,57.15 110.49,55.88 110.49,53.34 110.49,52.07 109.22,52.07 107.95,52.07 107.95,50.8 R14.1
  Bottom 1.016: U100.8 TP102.TP
ADS1115_A2
  Top 0.152: 118.11,53.34 R16.2
  Top 0.508: 118.11,52.07 116.84,53.34 116.84,53.76
  Top 1.35: R17.1 118.11,52.07 118.11,53.34 | R16.2 116.84,53.76 115.15,53.76 111.76,57.15 U100.9
  Bottom 1.016: U100.9 TP101.TP
ADS1115_A4
  Bottom 1.016: U100.10 TP100.TP
EN
  Top 1.016: U1.2 TP4.TP
FP_FB
  Top 0.152: 118.32,48.47 R17.2
  Top 1.016: J3.4 TP43.TP 134.62,48.68 132.08,46.14 120.65,46.14 118.32,48.47
GPIO01
  Top 1.016: U1.35 TP7.TP
GPIO02
  Top 1.016: U1.24 TP29.TP
GPIO03
  Top 1.016: U1.34 TP9.TP
GPIO06
  Top 1.016: U1.20 TP37.TP
GPIO07
  Top 1.016: U1.21 TP35.TP
GPIO08
  Top 1.016: U1.22 TP33.TP
GPIO09
  Top 1.016: U1.16 TP32.TP
GPIO10
  Top 1.016: U1.17 TP34.TP
GPIO11
  Top 1.016: U1.18 TP36.TP
GPIO12
  Top 1.016: U1.13 TP26.TP
GPIO13
  Top 1.016: U1.15 TP30.TP
GPIO14
  Top 1.016: U1.12 TP24.TP
GPIO15
  Top 1.016: U1.23 TP31.TP
GPIO25  (via drill 0.35)
  Top 0.152: 17.78,45.72 R3.2
  Top 0.61: v21.43,45.72 17.78,45.72
  Top 1.016: U1.9 TP18.TP
  Bottom 0.152: 31.76,45.72 33.03,44.45 33.02,44.45 U1.9
  Bottom 0.61: v21.43,45.72 31.76,45.72 31.76,45.71 U1.9
GPIO26  (via drill 0.35)
  Top 0.61: v21.43,49.53 R2.2
  Top 1.016: U1.10 TP20.TP
  Bottom 0.152: U1.10 31.76,48.26
  Bottom 0.61: U1.10 30.49,49.53 v21.43,49.53
GPIO27  (via drill 0.35)
  Top 0.152: 17.78,53.34 R1.2
  Top 0.61: v21.43,53.34 17.78,53.34
  Top 1.016: U1.11 TP22.TP
  Bottom 0.152: U1.11
  Bottom 0.61: v21.43,53.34 29.22,53.34 U1.11
GPIO32  (via drill 0.35)
  Top 0.61: v21.43,38.1 R5.2
  Top 1.016: U1.7 TP14.TP
  Bottom 0.152: U1.7
  Bottom 0.61: v21.43,38.1 34.3,38.1 U1.7
GPIO33  (via drill 0.35)
  Top 0.152: 17.78,41.91 R4.2
  Top 0.61: v21.43,41.91 17.78,41.91
  Top 1.016: U1.8 TP16.TP
  Bottom 0.61: U1.8 33.03,41.91 v21.43,41.91
GPIO34
  Top 0.61: TP10.TP 38.11,14.4 R9.1 37.68,12.71 S3.1
  Top 1.016: U1.5 TP10.TP
GPIO35
  Top 0.61: TP12.TP 47.84,19.47 R10.1 47.84,12.71 S4.1
  Top 1.016: U1.6 TP12.TP
GPIO36
  Top 0.152: TP6.TP 27.94,21.59
  Top 0.61: TP6.TP 27.94,21.59 17.78,21.59 17.36,21.17 R7.1 17.36,12.71 S1.1
  Top 1.016: U1.3 TP6.TP
GPIO39
  Top 0.61: TP8.TP 27.94,19.05 27.94,14.39 R8.1 27.52,12.71 S2.1
  Top 1.016: U1.4 TP8.TP
HBRDIGE_DISABLE
  Top 1.016: U1.25 TP27.TP
  Bottom 0.406: 71.35,45.95 71.12,45.72 63.5,45.72 60.97,48.25 U1.25 | TP115.TP 78.74,48.26 72.22,48.26 71.35,47.39 U101.11
  Bottom 0.65: U101.11 71.35,45.95
HBRIDGE_DIRECTION
  Top 1.016: U1.27 TP23.TP
  Bottom 0.152: 72.35,38.06 72.39,38.1 72.39,36.98 U101.1
  Bottom 0.406: U101.1 72.35,38.06 | U1.27 55.89,44.45 61.38,38.96 71.47,38.96 72.33,38.1 | TP113.TP 77.47,39.37 76.2,38.1 72.39,38.1
  Bottom 0.65: 72.33,38.1 72.39,38.1
HBRIDGE_PWM
  Top 1.016: U1.26 TP25.TP
  Bottom 0.406: TP114.TP 76.06,44.45 73.62,46.89 U101.12 72.35,45.62 71.33,44.59 60.83,44.59 58.43,46.99 U1.26
M0+
  Top 1.016: J2.3 TP44.TP
  Bottom 0.65: U101.5 68.35,34.93 | 68.35,34.93 68.35,33.66 | 68.35,33.02 68.35,31.98 69.22,31.11 69.53,31.43 69.53,32.07 | 70.48,31.75 70.05,31.75 | 69.85,31.75 69.62,31.75 | 70.48,31.75 70.48,32.16 68.78,33.86 | 68.35,34.93 68.78,34.49 68.78,33.86 | 70.01,31.59 69.85,31.75 | 69.85,31.75 69.53,32.07 | 69.53,32.07 68.78,32.82 68.78,33.86 | 68.35,33.66 69.42,32.59 | 70.48,32.38 70.25,32.38 70.05,32.59 68.78,32.59 68.35,33.02 | 70.48,31.75 70.64,31.59 71.12,31.11 TP111.TP | 68.35,33.02 68.35,33.66
  Bottom 1.27: 69.62,31.75 68.78,32.59
  Bottom 1.5: TP111.TP 79.38,30.48 78.74,30.48
  Bottom 2.54: 75.09,31.59 70.64,31.59 70.01,31.59 | 75.09,31.59 94.14,31.59 95.25,30.48 93.98,29.21 77.47,29.21 75.09,31.59
  Bottom 5.08: J2.3 134.62,16.51 120.65,30.48 95.25,30.48 92.71,30.48
M0-
  Top 1.016: J2.5 TP48.TP
  Bottom 0.65: 68.58,51.44 67.35,50.21 67.35,49.53 | U101.7 67.35,48.26 | 67.35,48.26 67.35,48.9 | 67.35,48.9 67.35,49.53 | 67.35,48.26 69.25,50.17 69.85,50.17 | 67.35,48.9 68.92,50.46 | 68.92,50.46 69.22,50.76 69.22,50.8 | 67.35,49.53 68.28,50.46 68.92,50.46 | 81.28,52.71 81.28,52.07 TP116.TP 82.55,53.34
  Bottom 2.54: 75.16,51.03 77.47,53.34 82.55,53.34 83.82,52.07 82.55,50.8 69.22,50.8
  Bottom 5.08: J2.5 144.78,31.75 138.43,38.1 106.68,38.1 92.71,52.07 83.82,52.07 81.28,52.07
N$1
  Bottom 5.08: J1.1 62.23,10.16 64.77,7.62 82.55,7.62 83.82,8.89 S5.2
N$2
  Top 0.152: R6.1 15.24,34.29 | 6.35,34.29 D6.2
  Top 0.61: D6.2 R6.1
N$3
  Top 0.152: 6.35,53.34 D1.2
  Top 0.61: D1.2 R1.1
N$7
  Top 0.152: 107.95,6.6 Q1.1
  Top 0.65: 107.95,6.6 110.22,6.6 Z1.2 115.47,8.14 R15.2
N$8
  Top 0.152: 6.35,49.53 D2.2
  Top 0.61: D2.2 R2.1
N$9
  Top 0.152: 6.35,45.72 D3.2
  Top 0.61: D3.2 R3.1
N$12
  Top 0.152: 6.35,41.91 D4.2
  Top 0.61: D4.2 R4.1
N$13
  Top 0.152: 6.35,38.1 D5.2
  Top 0.61: D5.2 R5.1
N$36
  Top 1.27: Q1.2 97.79,8.89
  Top 5.08: S5.1 92.12,8.89 97.79,8.89 100.33,8.89
N$41
  Bottom 1.016: U100.6 TP104.TP
SCL
  Top 1.016: U1.36 TP5.TP
  Bottom 1.016: U100.3 TP107.TP 96.52,63.5 94.61,65.41 36.2,65.41 33.02,62.23 U1.36
SDA
  Top 1.016: U1.33 TP11.TP
  Bottom 1.016: TP106.TP U100.4 99.06,57.15 97.79,55.88 80.01,55.88 73.66,62.23 41.91,62.23 40.64,60.96 40.64,55.89 40.65,55.88 U1.33
SPI_CLOCK
  Top 1.016: U1.30 TP17.TP
SPI_CS1
  Top 1.016: U1.29 TP19.TP
SPI_CS2
  Top 1.016: U1.28 TP21.TP
SPI_MISO
  Top 1.016: U1.31 TP15.TP
SPI_MOSI
  Top 1.016: U1.37 TP3.TP
TB_FB
  Top 0.152: 107.95,46.99 R14.2
  Top 1.016: J2.4 TP46.TP 139.7,31.75 129.54,41.91 109.22,41.91 107.95,43.18 107.95,46.99
TB_FB_INV
  Top 0.8: 124.46,16.51 124.46,17.78 123.19,19.05
  Top 1.016: J2.1 124.46,16.51 TP40.TP 123.19,19.05 121.92,19.05 102.87,38.1 R12.2

### Text on the board
tPlace: JLCJLCJLCJLC
bPlace: Heat Sink / Alignment | 12V
tNames: Foot Pedal Terminal Block | 0VDC | GPIO23 - MOSI | GPIO22 - SCL | GPIO01 | GPIO03 | GPIO21 - SDA | 0VDC | GPIO19 - MISO | GPIO18 - CLOCK | GPIO05 - CS1 | GPIO17 - CS2 | GPIO16 - H DIRECTION | GPIO04 - H PWM | GPIO00 - H Disable | GPIO02 | GPIO15 | GPIO8 | GPIO07 | GPIO06 | LED 1 | LED 2 | LED 3 | LED 4 | LED 5 | PWD | 3.3VDC | EN | GPIO36 | GPIO39 | GPIO34 | GPIO35 | LED 5 - GPIO32 | LED 4 - GPIO33 | LED 3 - GPIO25 | LED 2 - GPIO26 | LED 1 - GPIO27 | GPIO14 | GPIO12 | 0VDC | GPIO13 | GPIO09 | GPIO10 | GPIO11 | 5VDC | Throttle Body Terminal Block
bNames: 6. 5VDC | 5. 0VDC | 4. FP_FB | 3. 0VDC | 2. 5VDC | 1. 5VDC | 0VDC | GPIO23 - MOSI | GPIO22 - SCL | GPIO01 | GPIO03 | GPIO21 - SDA | 0VDC | GPIO19 - MISO | GPIO18 - CLOCK | GPIO05 - CS1 | GPIO17 - CS2 | GPIO16 - H DIRECTION | GPIO04 - H PWM | GPIO00 - H Disable | GPIO02 | GPIO15 | GPIO8 | GPIO07 | GPIO06 | Project: Throttle Body Control Platform / By: Oliver Bell, Piyapat Srisawat / Date: 01/08/2024 / Version: 2.0 | 3.3VDC | EN | GPIO36 | GPIO39 | GPIO34 | GPIO35 | LED 5 - GPIO32 | LED 4 - GPIO33 | LED 3 - GPIO25 | LED 2 - GPIO26 | LED 1 - GPIO27 | GPIO14 | GPIO12 | 0VDC | GPIO13 | GPIO09 | GPIO10 | GPIO11 | 5VDC | TB_FB_INV 1. | 5VDC 2. | M0+ 3. | TB_FB 4. | M0- 5. | 0VDC 6.
Notes: O.B | O.B